# Altium project 2022_AESK_UAV_POWER.PrjPcb
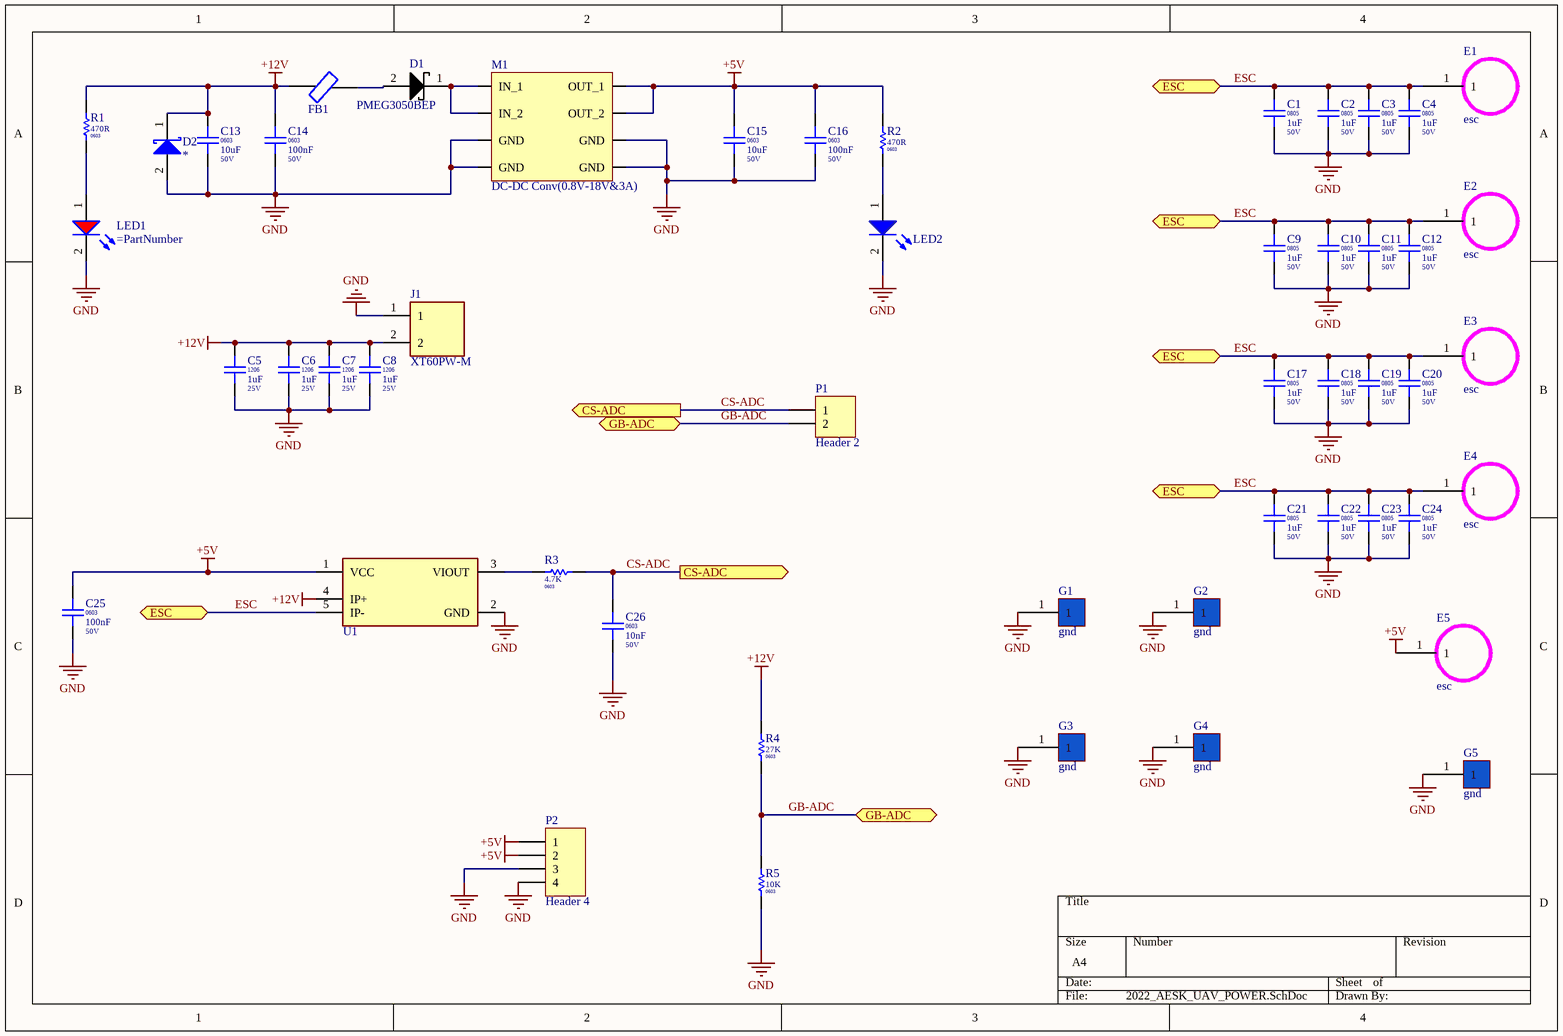
[diagram p0: 2022_AESK_UAV_POWER.SchDoc]
1 sheet, 51 parts. Net scope: flat (ports and power ports of the same name join across sheets).
Board file: 2022_AESK_UAV_POWER.PcbDoc

## Sheet 2022_AESK_UAV_POWER.SchDoc
size A4

### Parts
C1  Package / Case: 0805  Voltage: 50V  [CAPC 0805]  (hidden comment: 1uF)
C2  Package / Case: 0805  Voltage: 50V  [CAPC 0805]  (hidden comment: 1uF)
C3  Package / Case: 0805  Voltage: 50V  [CAPC 0805]  (hidden comment: 1uF)
C4  Package / Case: 0805  Voltage: 50V  [CAPC 0805]  (hidden comment: 1uF)
C5  Package / Case: 1206  Voltage: 25V  [CAPC 1206]  (hidden comment: 1uF)
C6  Package / Case: 1206  Voltage: 25V  [CAPC 1206]  (hidden comment: 1uF)
C7  Package / Case: 1206  Voltage: 25V  [CAPC 1206]  (hidden comment: 1uF)
C8  Package / Case: 1206  Voltage: 25V  [CAPC 1206]  (hidden comment: 1uF)
C9  Package / Case: 0805  Voltage: 50V  [CAPC 0805]  (hidden comment: 1uF)
C10  Package / Case: 0805  Voltage: 50V  [CAPC 0805]  (hidden comment: 1uF)
C11  Package / Case: 0805  Voltage: 50V  [CAPC 0805]  (hidden comment: 1uF)
C12  Package / Case: 0805  Voltage: 50V  [CAPC 0805]  (hidden comment: 1uF)
C13  Package / Case: 0603  Voltage: 50V  [CAPC 0603]  (hidden comment: 10uF)
C14  Package / Case: 0603  Voltage: 50V  [CAPC 0603]  (hidden comment: 100nF)
C15  Package / Case: 0603  Voltage: 50V  [CAPC 0603]  (hidden comment: 10uF)
C16  Package / Case: 0603  Voltage: 50V  [CAPC 0603]  (hidden comment: 100nF)
C17  Package / Case: 0805  Voltage: 50V  [CAPC 0805]  (hidden comment: 1uF)
C18  Package / Case: 0805  Voltage: 50V  [CAPC 0805]  (hidden comment: 1uF)
C19  Package / Case: 0805  Voltage: 50V  [CAPC 0805]  (hidden comment: 1uF)
C20  Package / Case: 0805  Voltage: 50V  [CAPC 0805]  (hidden comment: 1uF)
C21  Package / Case: 0805  Voltage: 50V  [CAPC 0805]  (hidden comment: 1uF)
C22  Package / Case: 0805  Voltage: 50V  [CAPC 0805]  (hidden comment: 1uF)
C23  Package / Case: 0805  Voltage: 50V  [CAPC 0805]  (hidden comment: 1uF)
C24  Package / Case: 0805  Voltage: 50V  [CAPC 0805]  (hidden comment: 1uF)
C25  Package / Case: 0603  Voltage: 50V  [CAPC 0603]  (hidden comment: 100nF)
C26  Package / Case: 0603  Voltage: 50V  [CAPC 0603]  (hidden comment: 10nF)
D1  PMEG3050BEP  [SOD470X100-2N]
D2  *  [DO-214AC, SMA]
E1  esc  [esc]
E2  esc  [esc]
E3  esc  [esc]
E4  esc  [esc]
E5  esc  [esc]
FB1  Ferrite Bead  [FCM1608KF-601T03]  (value not drawn)
G1  gnd  [gnd]
G2  gnd  [gnd]
G3  gnd  [gnd]
G4  gnd  [gnd]
G5  gnd  [gnd]
J1  XT60PW-M  [AMASS_XT60PW-M]
LED1  (no value)  [LED RED 0603]
LED2  (no value)  [LED BLUE 0603]
M1  DC-DC Conv(0.8V-18V&3A)  [mp]
P1  Header 2  [HDR1X2]
P2  Header 4  [HDR1X4]
R1  Package / Case: 0603  [RESC 0603]  (hidden comment: 470R)
R2  Package / Case: 0603  [RESC 0603]  (hidden comment: 470R)
R3  Package / Case: 0603  [RESC 0603]  (hidden comment: 4.7K)
R4  Package / Case: 0603  [RESC 0603]  (hidden comment: 27K)
R5  Package / Case: 0603  [RESC 0603]  (hidden comment: 10K)
U1  ACS758KCB-150B-PFF-T  [Allegro_MicroSystems_LLC_CB-5-PFF_MFG]  (value not drawn)

### Ports
CS-ADC (out), ESC (bidir), GB-ADC (bidir)

### Nets
+5V: C15.2 C16.2 C25.2 E5.1 M1.3(OUT_1) M1.4(OUT_2) P2.1 P2.2 R2.2 U1.1(VCC)
+12V: C5.2 C6.2 C7.2 C8.2 C13.2 C14.2 D2.1(K) FB1.1 J1.2 R1.2 R4.2 U1.4(IP+)
GND: C1.1 C2.1 C3.1 C4.1 C5.1 C6.1 C7.1 C8.1 C9.1 C10.1 C11.1 C12.1 C13.1 C14.1 C15.1 C16.1 C17.1 C18.1 C19.1 C20.1 C21.1 C22.1 C23.1 C24.1 C25.1 C26.1 D2.2(A) G1.1 G2.1 G3.1 G4.1 G5.1 J1.1 LED1.2(C) LED2.2(C) M1.5(GND) M1.6(GND) M1.7(GND) M1.8(GND) P2.3 P2.4 R5.1 U1.2(GND)
CS-ADC: C26.2 P1.1 R3.1 ; port CS-ADC
ESC: C1.2 C2.2 C3.2 C4.2 C9.2 C10.2 C11.2 C12.2 C17.2 C18.2 C19.2 C20.2 C21.2 C22.2 C23.2 C24.2 E1.1 E2.1 E3.1 E4.1 U1.5(IP-) ; port ESC
GB-ADC: P1.2 R4.1 R5.2 ; port GB-ADC
NetD1_1: D1.1(K) M1.1(IN_1) M1.2(IN_2)
NetD1_2: D1.2(A) FB1.2
NetLED1_1: LED1.1(A) R1.1
NetLED2_1: LED2.1(A) R2.1
NetR3_2: R3.2 U1.3(VIOUT)

### Library data of the parts
C1-C4 C9-C12 C17-C24 = CAPC0580: Capacitor Ceramic 1uF 50V 0805; Tolerance: %10; Value Rating: uF; Values: 1uF 50V; Favorites: Favorite; Value: 1uF; Part Number: CAPC0580; Category: Capacitor Ceramic
C5-C8 = CAPC0953: Capacitor Ceramic 1uF 25V 1206; Tolerance: %10; Value Rating: uF; Values: 1uF 25V; Value: 1uF; Part Number: CAPC0953; Category: Capacitor Ceramic
C13 C15 = CAPC0301: Capacitor Ceramic 10uF 50V 0603; Tolerance: %10; Value Rating: uF; Value: 10uF; Part Number: CAPC0301; Category: Capacitor Ceramic; Values: 10uF 50V
C14 C16 C25 = CAPC0285: Capacitor Ceramic 100nF 50V 0603; Tolerance: %10; Value Rating: nF; Favorites: Favorite; Value: 100nF; Part Number: CAPC0285; Category: Capacitor Ceramic; Values: 100nF 50V
C26 = CAPC0277: Capacitor Ceramic 10nF 50V 0603; Tolerance: %10; Value Rating: nF; Favorites: Favorite; Value: 10nF; Part Number: CAPC0277; Category: Capacitor Ceramic; Values: 10nF 50V
D1 = Schotky Diode: Manufacturer: Nexperia USA; Manufacturer Part Number: PMEG3050BEP,115; Supplier 1: Digi-Key; Supplier Part Number 1: 1727-5207-1-ND; Stock 1: 62590; Pricing 1: 1=0.44, 10=0.373, 100=0.2786, 500=0.2189, 1000=0.1692 (USD)
D2 = Diode0012: Values: FILL!!!; Diode Type: Schottky; Manufacturer Part Number: *; Part Number: Diode0012; Category: Diode Schottky; Package / Case: DO-214AC, SMA; Voltage - DC Reverse (Vr): FILL!!!; Voltage - Forward (Vf): FILL!!!; Current: FILL!!!; Speed: FILL!!!
FB1 = FCM1608KF-601T03
J1 = XT60PW-M: MF: AMASS; SnapEDA_Link: https://www.snapeda.com/parts/XT60PW-M%20/AMASS/view-part/3075559/?ref=snap; MP: XT60PW-M; Availability: Unavailable; Price: None; Value: *; Package: Package Analog Devices
LED1 = LED RED: LED
LED2 = LED BLUE: LED
M1 = MP1584EN
P1 = Header 2: Header, 2-Pin; LatestRevisionDate: 17-Jul-2002; LatestRevisionNote: Re-released for DXP Platform.; Publisher: Altium Limited
P2 = Header 4: Header, 4-Pin; LatestRevisionDate: 17-Jul-2002; LatestRevisionNote: Re-released for DXP Platform.; Publisher: Altium Limited
R1 R2 = R0188: 470R 0603; Part Number: R0188; Tolerance: %5; Power: 1/10W; Value: 470R; Category: Resistor; Values: 470R
R3 = R0212: 4.7K 0603; Part Number: R0212; Tolerance: %5; Power: 1/10W; Value: 4.7K; Category: Resistor; Values: 4.7K
R4 = R0230: 27K 0603; Part Number: R0230; Tolerance: %5; Power: 1/10W; Value: 27K; Category: Resistor; Values: 27K
R5 = R0220: 10K 0603; Part Number: R0220; Tolerance: %5; Power: 1/10W; Value: 10K; Category: Resistor; Values: 10K